# EAGLE design ToneWolf (EAGLE 7.5.0)
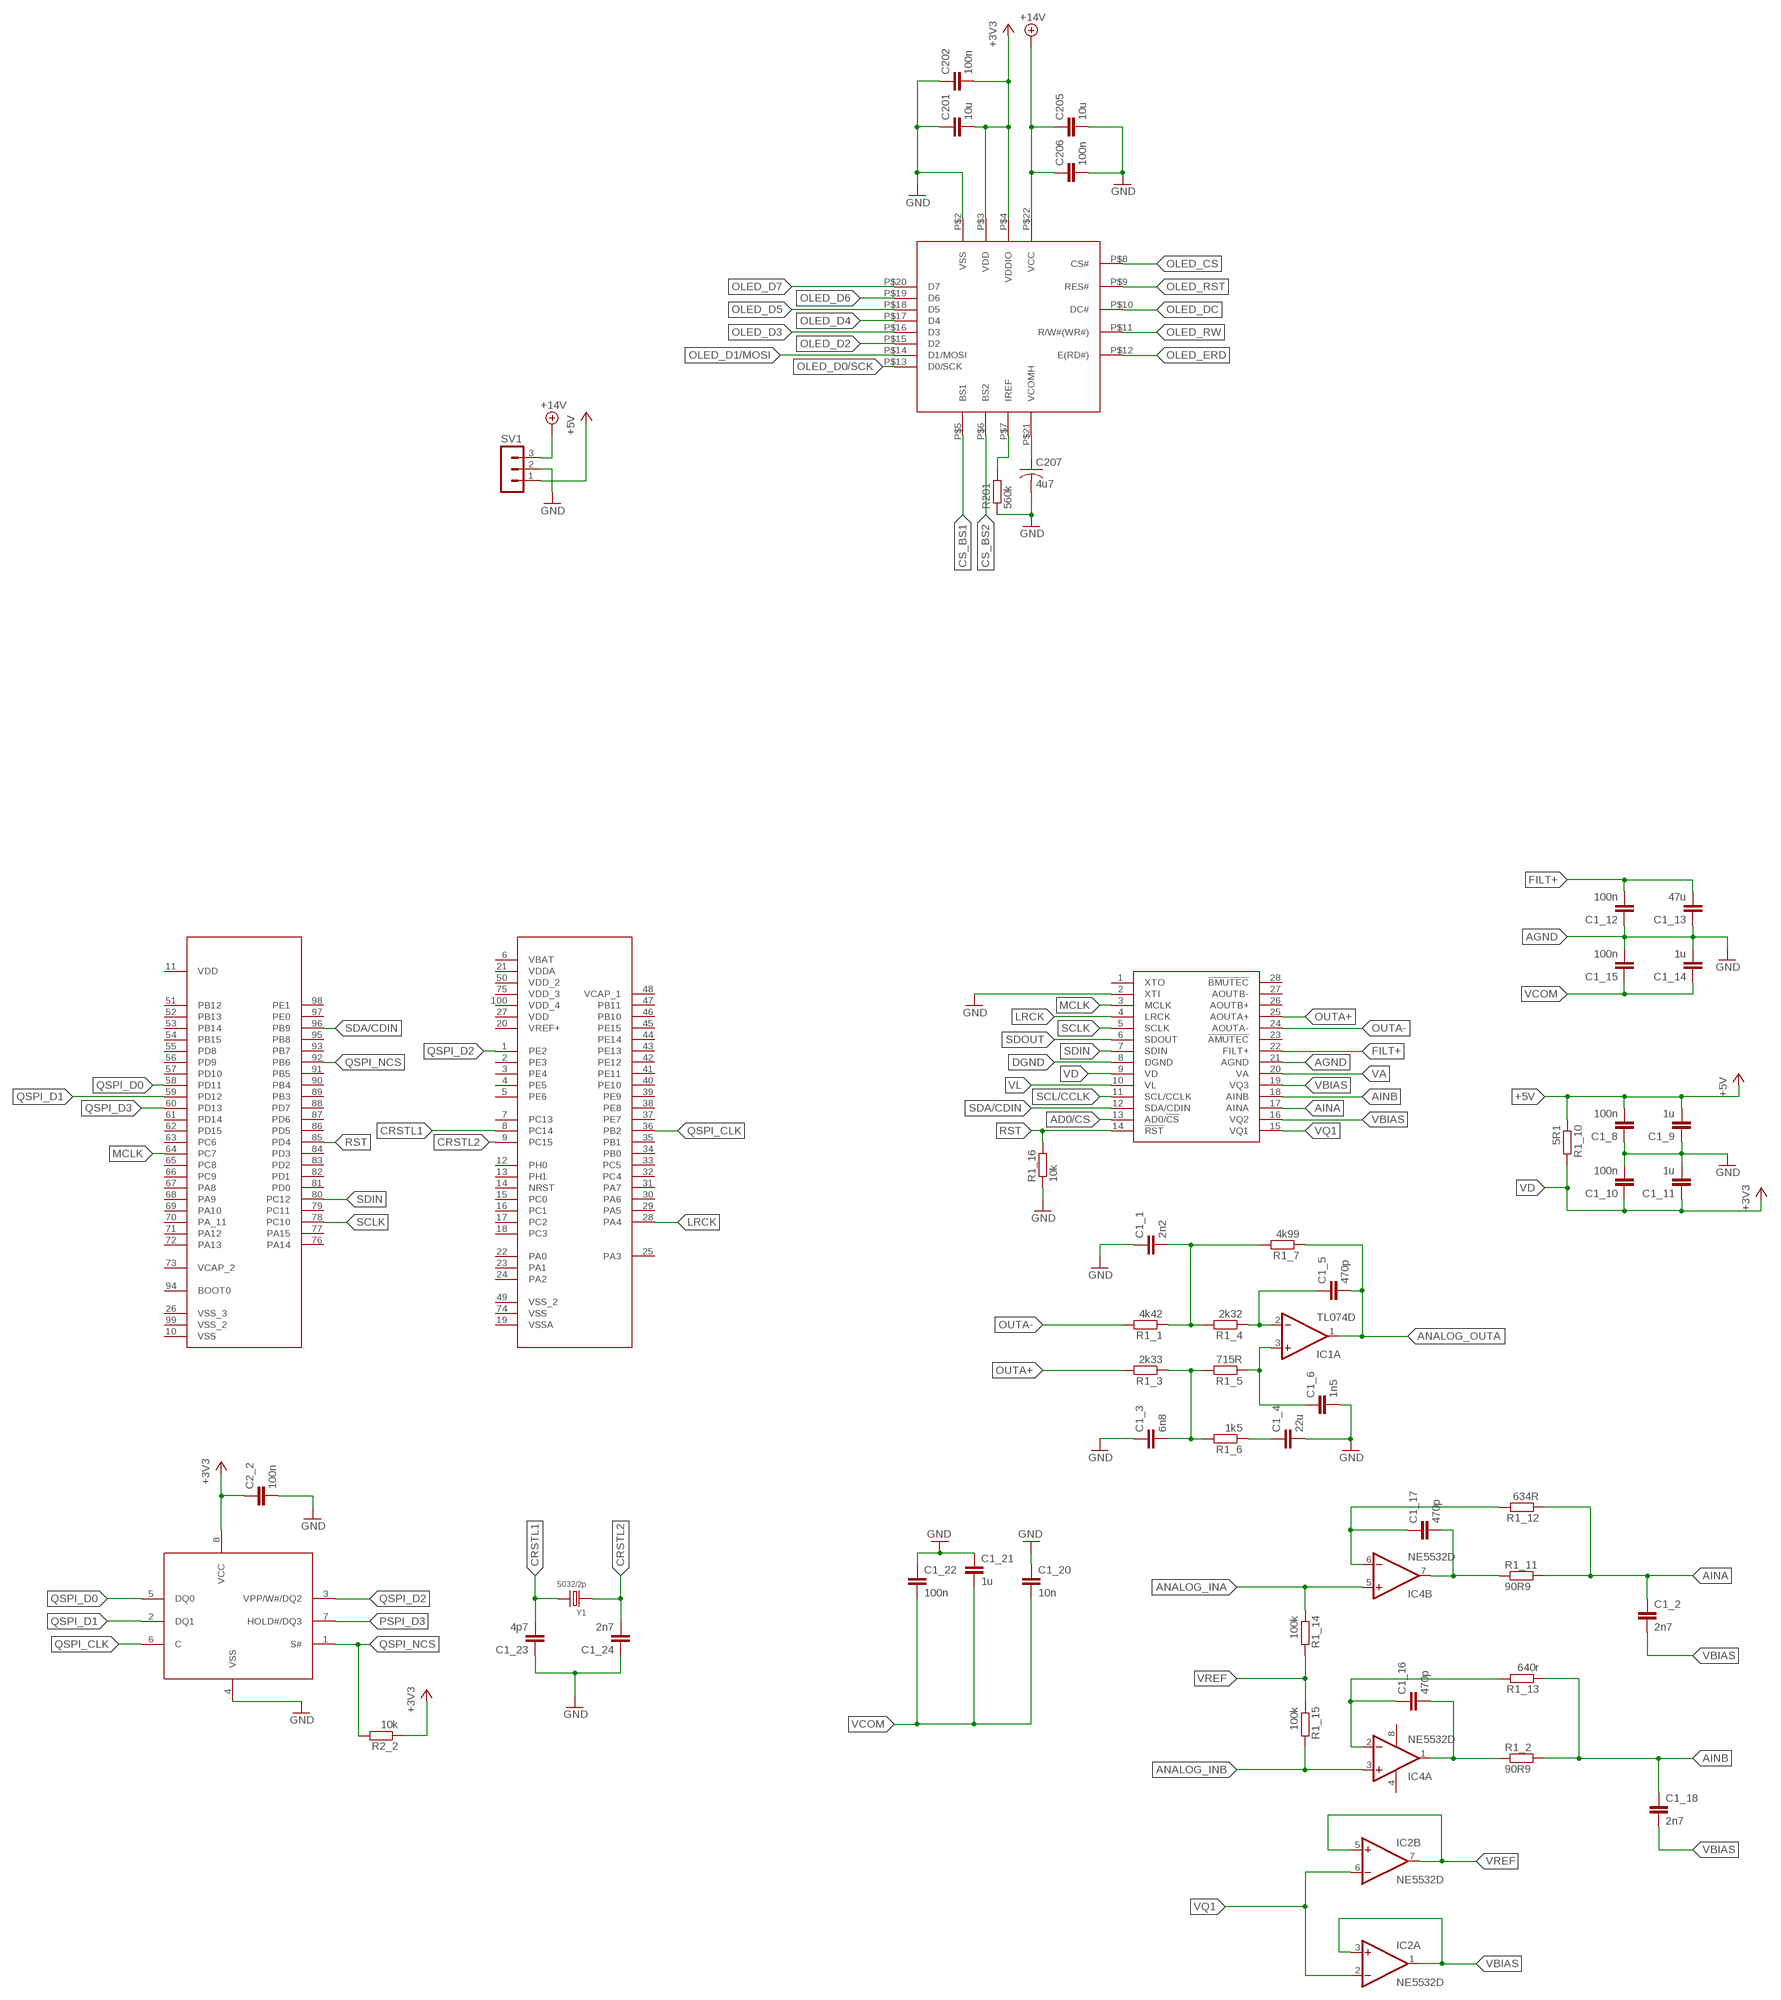
[diagram p0: schematic, sheet 1]

## Parts
C1_1  2n2  C-EUC0603  [C0603]
C1_2  2n7  C-EUC0603  [C0603]
C1_3  6n8  C-EUC0603  [C0603]
C1_4  22u  C-EUC0603  [C0603]
C1_5  470p  C-EUC0603  [C0603]
C1_6  1n5  C-EUC0603  [C0603]
C1_8  100n  C-EUC0603  [C0603]
C1_9  1u  C-EUC0603  [C0603]
C1_10  100n  C-EUC0603  [C0603]
C1_11  1u  C-EUC0603  [C0603]
C1_12  100n  C-EUC0603  [C0603]
C1_13  47u  C-EUC0603  [C0603]
C1_14  1u  C-EUC0603  [C0603]
C1_15  100n  C-EUC0603  [C0603]
C1_16  470p  C-EUC0603  [C0603]
C1_17  470p  C-EUC0603  [C0603]
C1_18  2n7  C-EUC0603  [C0603]
C1_20  10n  C-EUC0603  [C0603]
C1_21  1u  C-EUC0603  [C0603]
C1_22  100n  C-EUC0603  [C0603]
C1_23  4p7  C-EUC0603  [C0603]
C1_24  2n7  C-EUC0603  [C0603]
C2_2  100n  C-EUC0603  [C0603]
C201  10u  C-EUC0603  [C0603]
C202  100n  C-EUC0603  [C0603]
C205  10u  C-EUC0603  [C0603]
C206  100n  C-EUC0603  [C0603]
C207  4u7  C-USC0603  [C0603]
IC1  TL074D  [SO14]
IC2  NE5532D  [SO08]
IC4  NE5532D  [SO08]
R1_1  4k42  R-EU_R0603  [R0603]
R1_2  90R9  R-EU_R0603  [R0603]
R1_3  2k33  R-EU_R0603  [R0603]
R1_4  2k32  R-EU_R0603  [R0603]
R1_5  715R  R-EU_R0603  [R0603]
R1_6  1k5  R-EU_R0603  [R0603]
R1_7  4k99  R-EU_R0603  [R0603]
R1_10  5R1  R-EU_R0603  [R0603]
R1_11  90R9  R-EU_R0603  [R0603]
R1_12  634R  R-EU_R0603  [R0603]
R1_13  640r  R-EU_R0603  [R0603]
R1_14  100k  R-EU_R0603  [R0603]
R1_15  100k  R-EU_R0603  [R0603]
R1_16  10k  R-EU_R0603  [R0603]
R2_2  10k  R-EU_R0603  [R0603]
R201  560k  R-EU_R0603  [R0603]
SV1  MA03-1  [MA03-1]
U$3  MCOT096064AZ-RGBM  [MCOT096064AZ-RGBM]
U$4  CS4271  [TSSOP28-0.65-9.7X4.4MM]
U$5  STM32F746VGT6  [QFP50P1600X1600X160-100N]
U$6  N25Q128A13  [SO8W]
Y1  5032/2p  SMD-CRYSTAL-8MHZ-20PF-20PPM(2P-5.0X3.2MM)  [X2-SMD-5.0X3.2X1.3MM]

## Nets
+3V3: C2_2.1 C201.2 C202.2 R2_2.1 U$3.P$3(VDD) U$3.P$4(VDDIO) U$6.8(VCC)
+5V: C1_8.2 C1_9.2 R1_10.1 SV1.1
+14V: C205.1 C206.1 SV1.3 U$3.P$22(VCC)
AD0/CS: U$4.13(AD0/!CS)
AGND: C1_12.1 C1_13.1 C1_14.2 C1_15.2 U$4.21(AGND) ; supply symbol labelled GND
AINA: C1_2.1 R1_11.2 R1_12.1 U$4.17(AINA)
AINB: C1_18.1 R1_2.2 R1_13.1 U$4.18(AINB)
ANALOG_INA: IC4.5(B:+IN) R1_14.1
ANALOG_INB: IC4.3(A:+IN) R1_15.2
ANALOG_OUTA: C1_5.2 IC1.1(A:OUT) R1_7.1
CRSTL1: C1_23.2 U$5.8(PC14) Y1.2
CRSTL2: C1_24.2 U$5.9(PC15) Y1.1
CS_BS1: U$3.P$5(BS1)
CS_BS2: U$3.P$6(BS2)
DGND: U$4.8(DGND)
FILT+: C1_12.2 C1_13.2 U$4.22(FILT+)
GND: C1_1.1 C1_3.1 C1_4.2 C1_6.2 C1_8.1 C1_9.1 C1_10.2 C1_11.2 C1_20.1 C1_21.1 C1_22.1 C1_23.1 C1_24.1 C2_2.2 C201.1 C202.1 C205.2 C206.2 C207.2 R1_16.1 R201.1 SV1.2 U$3.P$2(VSS) U$4.2(XTI) U$6.4(VSS)
LRCK: U$4.4(LRCK) U$5.28(PA4)
MCLK: U$4.3(MCLK) U$5.64(PC7)
N$1: C1_3.2 R1_3.1 R1_5.2 R1_6.2
N$6: C207.1 U$3.P$21(VCOMH)
N$8: R201.2 U$3.P$7(IREF)
N$10: C1_1.2 R1_1.1 R1_4.2 R1_7.2
N$11: C1_4.1 R1_6.1
N$13: C1_5.1 IC1.2(A:-IN) R1_4.1
N$14: C1_6.1 IC1.3(A:+IN) R1_5.1
N$16: C1_16.2 IC4.1(A:OUT) R1_2.1
N$18: C1_17.2 IC4.7(B:OUT) R1_11.1
N$19: C1_16.1 IC4.2(A:-IN) R1_13.2
N$21: C1_17.1 IC4.6(B:-IN) R1_12.2
OLED_CS: U$3.P$8(CS#)
OLED_D0/SCK: U$3.P$13(D0/SCK)
OLED_D1/MOSI: U$3.P$14(D1/MOSI)
OLED_D2: U$3.P$15(D2)
OLED_D3: U$3.P$16(D3)
OLED_D4: U$3.P$17(D4)
OLED_D5: U$3.P$18(D5)
OLED_D6: U$3.P$19(D6)
OLED_D7: U$3.P$20(D7)
OLED_DC: U$3.P$10(DC#)
OLED_ERD: U$3.P$12(E(RD#))
OLED_RST: U$3.P$9(RES#)
OLED_RW: U$3.P$11(R/W#(WR#))
OUTA+: R1_3.2 U$4.25(AOUTA+)
OUTA-: R1_1.2 U$4.24(AOUTA-)
PSPI_D3: U$6.7(HOLD#/DQ3)
QSPI_CLK: U$5.36(PB2) U$6.6(C)
QSPI_D0: U$5.58(PD11) U$6.5(DQ0)
QSPI_D1: U$5.59(PD12) U$6.2(DQ1)
QSPI_D2: U$5.1(PE2) U$6.3(VPP/W#/DQ2)
QSPI_D3: U$5.60(PD13)
QSPI_NCS: R2_2.2 U$5.92(PB6) U$6.1(S#)
RST: R1_16.2 U$4.14(!RST) U$5.85(PD4)
SCL/CCLK: U$4.11(SCL/CCLK)
SCLK: U$4.5(SCLK) U$5.78(PC10)
SDA/CDIN: U$4.12(SDA/CDIN) U$5.96(PB9)
SDIN: U$4.7(SDIN) U$5.80(PC12)
SDOUT: U$4.6(SDOUT)
VA: U$4.20(VA)
VBIAS: C1_2.2 C1_18.2 IC2.1(A:OUT) IC2.3(A:+IN) U$4.16(VQ2) U$4.19(VQ3)
VCOM: C1_14.1 C1_15.1 C1_20.2 C1_21.2 C1_22.2
VD: C1_10.1 C1_11.1 R1_10.2 U$4.9(VD) ; supply symbol labelled +3V3
VL: U$4.10(VL)
VQ1: IC2.2(A:-IN) IC2.6(B:-IN) U$4.15(VQ1)
VREF: IC2.5(B:+IN) IC2.7(B:OUT) R1_14.2 R1_15.1
Unconnected: IC1.5(B:+IN) IC1.6(B:-IN) IC1.7(B:OUT) IC1.8(C:OUT) IC1.9(C:-IN) IC1.10(C:+IN) IC1.12(D:+IN) IC1.13(D:-IN) IC1.14(D:OUT) U$4.1(XTO) U$4.23(!AMUTEC) U$4.26(AOUTB+) U$4.27(AOUTB-) U$4.28(!BMUTEC) U$5.2(PE3) U$5.3(PE4) U$5.4(PE5) U$5.5(PE6) U$5.6(VBAT) U$5.7(PC13) U$5.10(VSS) U$5.11(VDD) U$5.12(PH0) U$5.13(PH1) U$5.14(NRST) U$5.15(PC0) U$5.16(PC1) U$5.17(PC2) U$5.18(PC3) U$5.19(VSSA) U$5.20(VREF+) U$5.21(VDDA) U$5.22(PA0) U$5.23(PA1) U$5.24(PA2) U$5.25(PA3) U$5.26(VSS_3) U$5.27(VDD) U$5.29(PA5) U$5.30(PA6) U$5.31(PA7) U$5.32(PC4) U$5.33(PC5) U$5.34(PB0) U$5.35(PB1) U$5.37(PE7) U$5.38(PE8) U$5.39(PE9) U$5.40(PE10) U$5.41(PE11) U$5.42(PE12) U$5.43(PE13) U$5.44(PE14) U$5.45(PE15) U$5.46(PB10) U$5.47(PB11) U$5.48(VCAP_1) U$5.49(VSS_2) U$5.50(VDD_2) U$5.51(PB12) U$5.52(PB13) U$5.53(PB14) U$5.54(PB15) U$5.55(PD8) U$5.56(PD9) U$5.57(PD10) U$5.61(PD14) U$5.62(PD15) U$5.63(PC6) U$5.65(PC8) U$5.66(PC9) U$5.67(PA8) U$5.68(PA9) U$5.69(PA10) U$5.70(PA_11) U$5.71(PA12) U$5.72(PA13) U$5.73(VCAP_2) U$5.74(VSS) U$5.75(VDD_3) U$5.76(PA14) U$5.77(PA15) U$5.79(PC11) U$5.81(PD0) U$5.82(PD1) U$5.83(PD2) U$5.84(PD3) U$5.86(PD5) U$5.87(PD6) U$5.88(PD7) U$5.89(PB3) U$5.90(PB4) U$5.91(PB5) U$5.93(PB7) U$5.94(BOOT0) U$5.95(PB8) U$5.97(PE0) U$5.98(PE1) U$5.99(VSS_2) U$5.100(VDD_4)

## Power pins joined to a net without a drawn wire
V+: IC1.4(P:V+) IC2.8(P:V+) IC4.8(P:V+)
V-: IC1.11(P:V-) IC2.4(P:V-) IC4.4(P:V-)

## Library data of the parts
C1_1-C1_6 C1_8-C1_18 C1_20-C1_24 C2_2 C201 C202 C205 C206 = rcl:C-EU: CAPACITOR, European symbol
C207 = rcl:C-US: CAPACITOR, American symbol
IC1 = linear:TL074: OP AMP
IC2 IC4 = linear:NE5532: AUDIO AMPLIFIER
R1_1-R1_7 R1_10-R1_16 R2_2 R201 = rcl:R-EU_: RESISTOR, European symbol
SV1 = con-lstb:MA03-1: PIN HEADER; OC_FARNELL: unknown; OC_NEWARK: unknown
U$3 = MCOT096064AZ-RGBM:MCOT096064AZ-RGBM: Midas 0.95in Red, Green, Blue Passive matrix OLED Display 96 x 64 TAB Multi Interface
U$4 = Rebel:CS4271
U$5 = Rebel_copy:STM32F746VGT6: STM32F746VGT6
U$6 = Rebel_copy:N25Q128A13: N25Q128A13 Flash Memory SO8W
Y1 = Seeed-OPL-crystal-osctllator:SMD-CRYSTAL-8MHZ-20PF-20PPM(2P-5.0X3.2MM): 306010004; MPN: 5032/2P

## Board
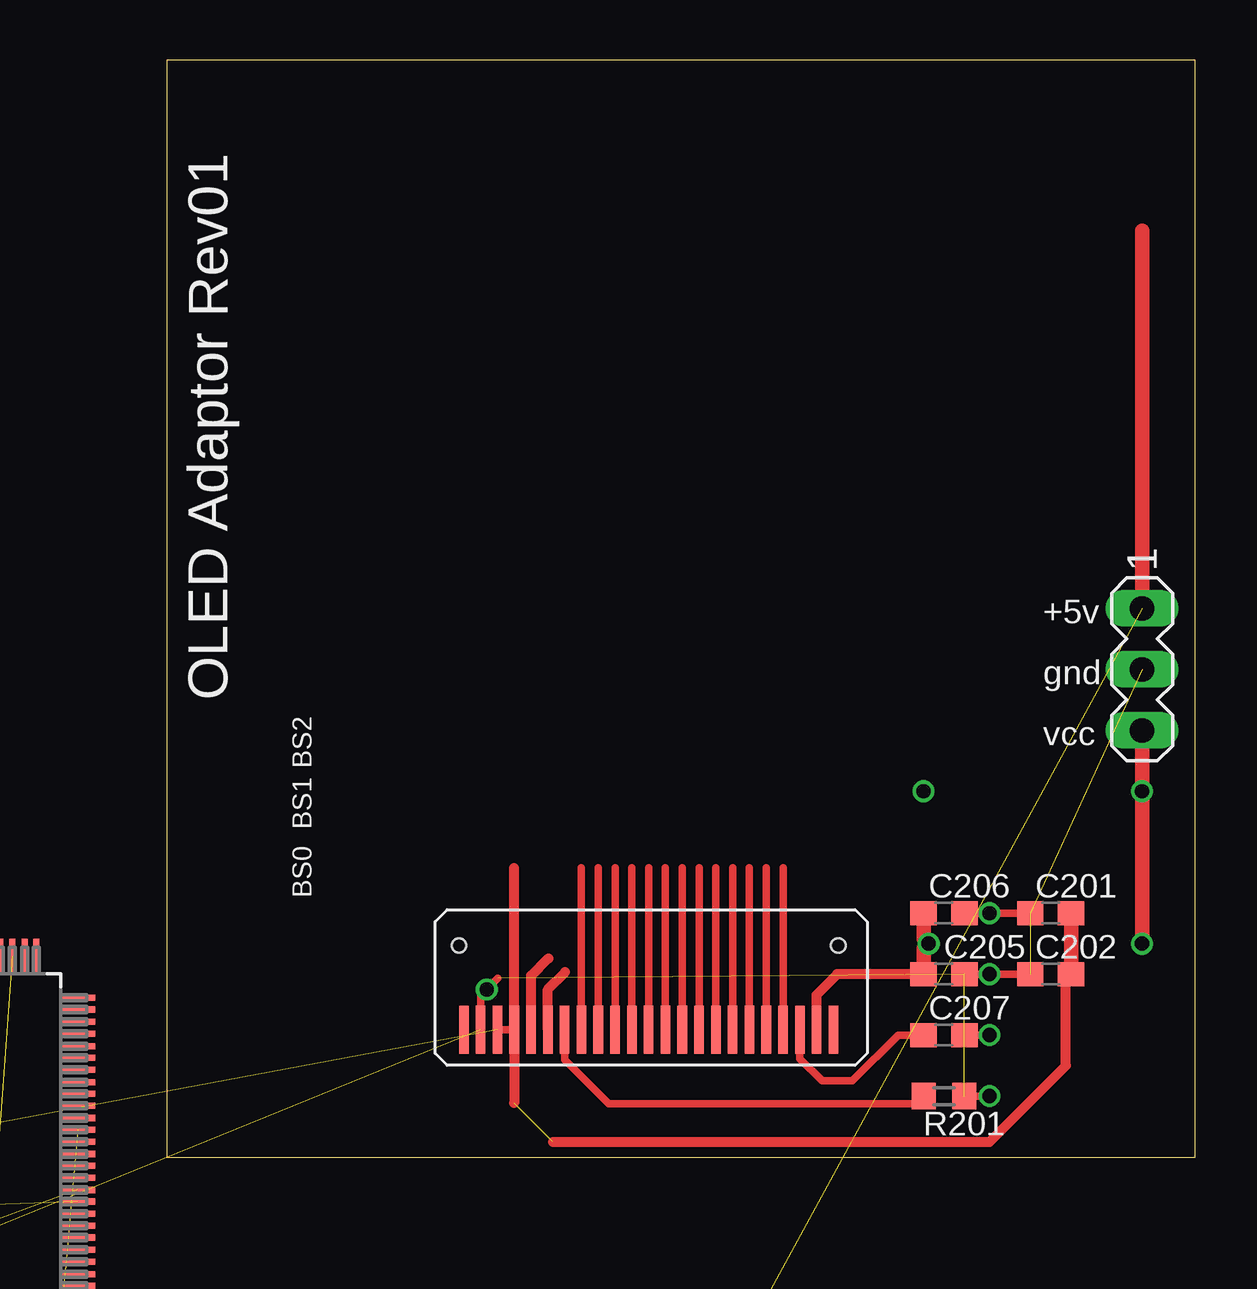
[diagram p1: board, top side]
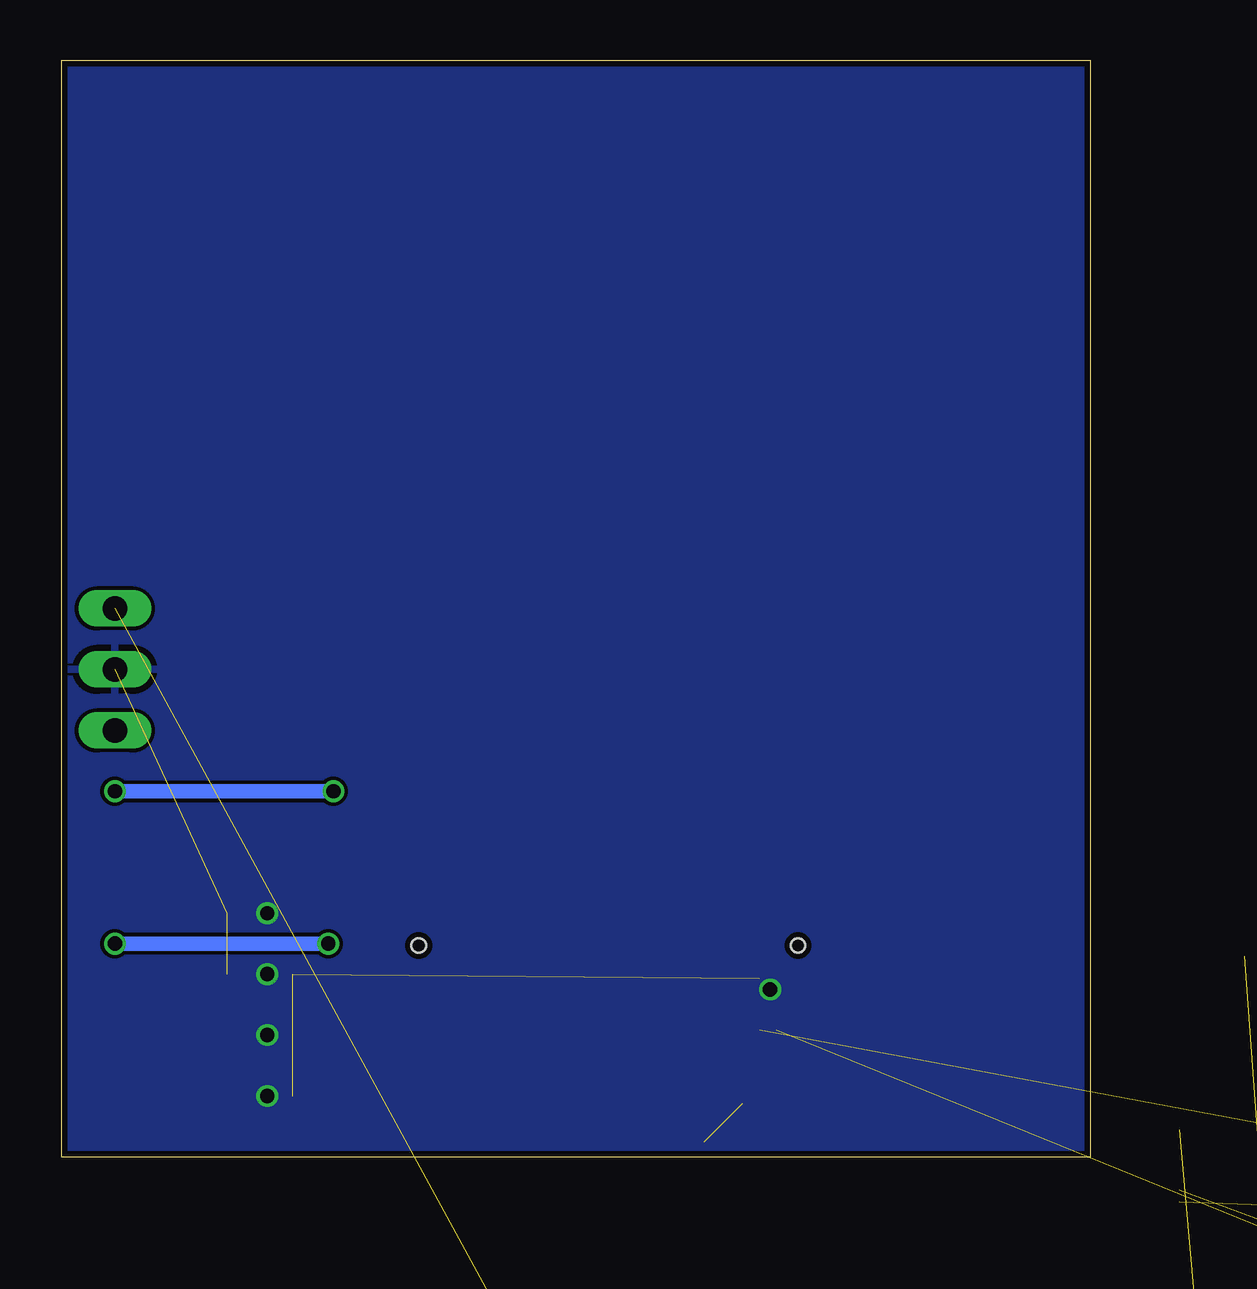
[diagram p2: board, bottom side, seen from below]

Size 42.85 x 45.71 mm. Coordinates in mm from the lower left corner, seen from the top.
Outline: 0,0 42.85,0 42.85,45.71 0,45.71 0,0
Copper layers (1*16): Top 0.035mm / dielectric 1.5mm / Bottom 0.035mm
Design rules "SeeedStudio_2layer_DRU_no_angle_20140221": minimum track width 6mil, minimum drill 12mil, track to track 6mil, track to pad 6mil, pad to pad 6mil, via to via 6mil, smd to smd 0mil, copper to edge 10mil, drill to drill 10mil, minimum pad ring 10mil, minimum via ring 6mil, stop-mask expansion 2mil, vias tented up to drill 100mil, thermal gap 10mil

### Footprints (pad centres in the part's own frame; a part is rotated, then mirrored left to right if it is on the bottom)
C0603 = smd 1.1 x 1: 1 -0.85,0; 2 0.85,0
SO14 = smd 0.6 x 2.2: 1 -3.81,-2.6; 2 -2.54,-2.6; 3 -1.27,-2.6; 4 0,-2.6; 5 1.27,-2.6; 6 2.54,-2.6; 7 3.81,-2.6; 8 3.81,2.6; 9 2.54,2.6; 10 1.27,2.6; 11 0,2.6; 12 -1.27,2.6; 13 -2.54,2.6; 14 -3.81,2.6
SO08 = smd 0.6 x 2.2: 1 -1.905,-2.6; 2 -0.635,-2.6; 3 0.635,-2.6; 4 1.905,-2.6; 5 1.905,2.6; 6 0.635,2.6; 7 -0.635,2.6; 8 -1.905,2.6
R0603 = smd 1 x 1.1: 1 -0.85,0; 2 0.85,0
MA03-1 = drill 1.016 long: 1 -2.54,0; 2 0,0; 3 2.54,0
MCOT096064AZ-RGBM = smd 0.4 x 2: P$1 -7.72,-2.024; P$2 -7.02,-2.024; P$3 -6.32,-2.024; P$4 -5.62,-2.024; P$5 -4.92,-2.024; P$6 -4.22,-2.024; P$7 -3.52,-2.024; P$8 -2.82,-2.024; P$9 -2.12,-2.024; P$10 -1.42,-2.024; P$11 -0.72,-2.024; P$12 -0.02,-2.024; P$13 0.68,-2.024; P$14 1.38,-2.024; P$15 2.08,-2.024; P$16 2.78,-2.024; P$17 3.48,-2.024; P$18 4.18,-2.024; P$19 4.88,-2.024; P$20 5.58,-2.024; P$21 6.28,-2.024; P$22 6.98,-2.024; P$23 7.68,-2.024 | hole 0.6: -7.92,1.476; 7.88,1.476
TSSOP28-0.65-9.7X4.4MM = smd 0.4 x 1.15: 1 -4.225,-3.1; 2 -3.575,-3.1; 3 -2.925,-3.1; 4 -2.275,-3.1; 5 -1.625,-3.1; 6 -0.975,-3.1; 7 -0.325,-3.1; 8 0.325,-3.1; 9 0.975,-3.1; 10 1.625,-3.1; 11 2.275,-3.1; 12 2.925,-3.1; 13 3.575,-3.1; 14 4.225,-3.1; 15 4.225,3.1; 16 3.575,3.1; 17 2.925,3.1; 18 2.275,3.1; 19 1.625,3.1; 20 0.975,3.1; 21 0.325,3.1; 22 -0.325,3.1; 23 -0.975,3.1; 24 -1.625,3.1; 25 -2.275,3.1; 26 -2.925,3.1; 27 -3.575,3.1; 28 -4.225,3.1
QFP50P1600X1600X160-100N = smd 1.473 x 0.254: 1 -7.722,5.994; 2 -7.722,5.512; 3 -7.722,5.004; 4 -7.722,4.496; 5 -7.722,3.988; 6 -7.722,3.505; 7 -7.722,2.997; 8 -7.722,2.489; 9 -7.722,2.007; 10 -7.722,1.499; 11 -7.722,0.991; 12 -7.722,0.508; 13 -7.722,0; 14 -7.722,-0.508; 15 -7.722,-0.991; 16 -7.722,-1.499; 17 -7.722,-2.007; 18 -7.722,-2.489; 19 -7.722,-2.997; 20 -7.722,-3.505; 21 -7.722,-3.988; 22 -7.722,-4.496; 23 -7.722,-5.004; 24 -7.722,-5.512; 25 -7.722,-5.994; 51 7.722,-5.994; 52 7.722,-5.512; 53 7.722,-5.004; 54 7.722,-4.496; 55 7.722,-3.988; 56 7.722,-3.505; 57 7.722,-2.997; 58 7.722,-2.489; 59 7.722,-2.007; 60 7.722,-1.499; 61 7.722,-0.991; 62 7.722,-0.508; 63 7.722,0; 64 7.722,0.508; 65 7.722,0.991; 66 7.722,1.499; 67 7.722,2.007; 68 7.722,2.489; 69 7.722,2.997; 70 7.722,3.505; 71 7.722,3.988; 72 7.722,4.496; 73 7.722,5.004; 74 7.722,5.512; 75 7.722,5.994 | smd 0.254 x 1.473: 26 -5.994,-7.722; 27 -5.512,-7.722; 28 -5.004,-7.722; 29 -4.496,-7.722; 30 -3.988,-7.722; 31 -3.505,-7.722; 32 -2.997,-7.722; 33 -2.489,-7.722; 34 -2.007,-7.722; 35 -1.499,-7.722; 36 -0.991,-7.722; 37 -0.508,-7.722; 38 0,-7.722; 39 0.508,-7.722; 40 0.991,-7.722; 41 1.499,-7.722; 42 2.007,-7.722; 43 2.489,-7.722; 44 2.997,-7.722; 45 3.505,-7.722; 46 3.988,-7.722; 47 4.496,-7.722; 48 5.004,-7.722; 49 5.512,-7.722; 50 5.994,-7.722; 76 5.994,7.722; 77 5.512,7.722; 78 5.004,7.722; 79 4.496,7.722; 80 3.988,7.722; 81 3.505,7.722; 82 2.997,7.722; 83 2.489,7.722; 84 2.007,7.722; 85 1.499,7.722; 86 0.991,7.722; 87 0.508,7.722; 88 0,7.722; 89 -0.508,7.722; 90 -0.991,7.722; 91 -1.499,7.722; 92 -2.007,7.722; 93 -2.489,7.722; 94 -2.997,7.722; 95 -3.505,7.722; 96 -3.988,7.722; 97 -4.496,7.722; 98 -5.004,7.722; 99 -5.512,7.722; 100 -5.994,7.722
SO8W = smd 0.6 x 2.2: 1 -1.905,-3.75; 2 -0.635,-3.75; 3 0.635,-3.75; 4 1.905,-3.75; 5 1.905,3.75; 6 0.635,3.75; 7 -0.635,3.75; 8 -1.905,3.75
X2-SMD-5.0X3.2X1.3MM = smd 1.778 x 2.032: 1 -2.159,0; 2 2.159,0

### Placement (x,y rotation side)
C1_1  -29.84,-44.45 0 top  (outside the outline)
C1_2  -29.84,-155.58 0 top  (outside the outline)
C1_3  -29.84,-49.53 0 top  (outside the outline)
C1_4  -29.84,-64.77 0 top  (outside the outline)
C1_5  -29.84,-79.38 0 top  (outside the outline)
C1_6  -29.84,-84.45 0 top  (outside the outline)
C1_8  -29.84,-104.77 0 top  (outside the outline)
C1_9  -29.84,-109.85 0 top  (outside the outline)
C1_10  -29.84,-114.93 0 top  (outside the outline)
C1_11  -29.84,-120.02 0 top  (outside the outline)
C1_12  -29.84,-125.09 0 top  (outside the outline)
C1_13  -29.84,-130.18 0 top  (outside the outline)
C1_14  -29.84,-135.25 0 top  (outside the outline)
C1_15  -29.84,-140.34 0 top  (outside the outline)
C1_16  -29.84,-200.03 0 top  (outside the outline)
C1_17  -29.84,-205.11 0 top  (outside the outline)
C1_18  -29.84,-286.38 0 top  (outside the outline)
C1_20  -29.84,-230.5 0 top  (outside the outline)
C1_21  -29.84,-235.59 0 top  (outside the outline)
C1_22  -29.84,-240.67 0 top  (outside the outline)
C1_23  -29.84,-266.7 0 top  (outside the outline)
C1_24  -29.84,-271.78 0 top  (outside the outline)
C2_2  -29.84,-13.97 0 top  (outside the outline)
C201  36.83,10.16 0 top
C202  36.83,7.62 0 top
C205  32.38,7.62 0 top
C206  32.38,10.16 0 top
C207  32.38,5.08 0 top
IC1  -24.77,-248.92 0 top  (outside the outline)
IC2  -45.09,-304.17 0 top  (outside the outline)
IC4  -36.2,-304.17 0 top  (outside the outline)
R1_1  -29.84,-24.13 0 top  (outside the outline)
R1_2  -29.84,-179.71 0 top  (outside the outline)
R1_3  -29.84,-29.21 0 top  (outside the outline)
R1_4  -29.84,-34.29 0 top  (outside the outline)
R1_5  -29.84,-39.37 0 top  (outside the outline)
R1_6  -29.84,-54.61 0 top  (outside the outline)
R1_7  -29.84,-59.69 0 top  (outside the outline)
R1_10  -29.84,-145.42 0 top  (outside the outline)
R1_11  -29.84,-184.78 0 top  (outside the outline)
R1_12  -29.84,-189.87 0 top  (outside the outline)
R1_13  -29.84,-194.95 0 top  (outside the outline)
R1_14  -29.84,-220.34 0 top  (outside the outline)
R1_15  -29.84,-225.43 0 top  (outside the outline)
R1_16  -29.84,-255.27 0 top  (outside the outline)
R2_2  -29.84,-19.05 0 top  (outside the outline)
R201  32.38,2.54 180 top
SV1  40.64,20.32 270 top
U$3  20.1,7.33 0 top
U$4  -26.04,-280.04 0 top  (outside the outline)
U$5  -11.43,0.64 0 top  (outside the outline)
U$6  -26.67,-6.35 0 top  (outside the outline)
Y1  -27.3,-260.99 0 top  (outside the outline)

### Tracks (layer width: path | path; a pad name or v marks a point on that pad's centre or on a via)
+3V3  (4 unrouted)
  Top 0.305: 37.47,7.4 C202.2 | U$3.P$3 U$3.P$4
  Top 0.406: 14.48,12.05 U$3.P$4 14.48,2.25 | 16.09,0.64 34.29,0.64 37.47,3.81 37.47,7.4
  Top 0.61: C202.2 C201.2
+5V  (3 unrouted)
  Top 0.61: SV1.1 40.64,38.59
+14V  (via drill 0.6)
  Top 0.406: C205.1 27.94,7.62 27.08,6.76 U$3.P$22
  Top 0.61: SV1.3 v40.64,15.24 v40.64,8.89 | C206.1 31.54,9.11 v31.75,8.89 31.54,8.67 C205.1
  Bottom 0.61: v40.64,15.24 v31.54,15.24 | v31.75,8.89 v40.64,8.89
AGND  (4 unrouted)
AINA  (3 unrouted)
AINB  (3 unrouted)
ANALOG_INA  (1 unrouted)
ANALOG_INB  (1 unrouted)
ANALOG_OUTA  (2 unrouted)
CRSTL1  (2 unrouted)
CRSTL2  (2 unrouted)
CS_BS1
  Top 0.406: U$3.P$5 15.18,7.56 15.9,8.28
CS_BS2
  Top 0.406: U$3.P$6 15.88,6.99 16.6,7.71
FILT+  (2 unrouted)
GND  (via drill 0.6)  (22 unrouted)
  Top 0.305: U$3.P$2 13.08,6.73 v13.34,6.98 13.8,7.45 | R201.1 v34.29,2.54 | C206.2 v34.29,10.16 C201.1 | C205.2 v34.29,7.62 C202.1 | C207.2 v34.29,5.08
  pour Bottom: -1.91,48.26 48.26,48.26 48.26,-1.27 -1.91,-1.27
LRCK  (1 unrouted)
MCLK  (1 unrouted)
N$1  (3 unrouted)
N$6
  Top 0.305: C207.1 30.48,5.08 28.57,3.17 27.3,3.17 26.38,4.1 U$3.P$21
N$8
  Top 0.305: U$3.P$7 16.58,4.06 18.41,2.22 31.22,2.22 R201.2
N$10  (3 unrouted)
N$11  (1 unrouted)
N$13  (2 unrouted)
N$14  (2 unrouted)
N$16  (2 unrouted)
N$18  (2 unrouted)
N$19  (2 unrouted)
N$21  (2 unrouted)
OLED_CS
  Top 0.305: U$3.P$8 17.28,12.05
OLED_D0/SCK
  Top 0.305: U$3.P$13 20.78,12.05
OLED_D1/MOSI
  Top 0.305: U$3.P$14 21.48,12.05
OLED_D2
  Top 0.305: U$3.P$15 22.18,12.05
OLED_D3
  Top 0.305: U$3.P$16 22.88,12.05
OLED_D4
  Top 0.305: U$3.P$17 23.58,12.05
OLED_D5
  Top 0.305: U$3.P$18 24.28,12.05
OLED_D6
  Top 0.305: U$3.P$19 24.98,12.05
OLED_D7
  Top 0.305: U$3.P$20 25.68,12.05
OLED_DC
  Top 0.305: U$3.P$10 18.68,12.05
OLED_ERD
  Top 0.305: U$3.P$12 20.08,12.05
OLED_RST
  Top 0.305: U$3.P$9 17.98,12.05
OLED_RW
  Top 0.305: U$3.P$11 19.38,12.05
OUTA+  (1 unrouted)
OUTA-  (1 unrouted)
QSPI_CLK  (1 unrouted)
QSPI_D0  (1 unrouted)
QSPI_D1  (1 unrouted)
QSPI_D2  (1 unrouted)
QSPI_NCS  (2 unrouted)
RST  (2 unrouted)
SCLK  (1 unrouted)
SDA/CDIN  (1 unrouted)
SDIN  (1 unrouted)
V+  (2 unrouted)
V-  (2 unrouted)
VBIAS  (5 unrouted)
VCOM  (4 unrouted)
VD  (3 unrouted)
VQ1  (2 unrouted)
VREF  (3 unrouted)

### Text on the board
tPlace: +5v | gnd | OLED Adaptor Rev01 | vcc | BS2 | BS1 | BS0